# EasyEDA Pro project SmartHome-Voice-Assit.epro, schematic SubBoard
Board Name: SubBoard_v1.1; Create Date: 2025-05-21; Page Name: P1; Project Name: ESP-Spot-Remake; Schematic Name: SubBoard; Update Date: 2025-05-20; Company: 嘉立创EDA; Page Size: A4; Version: V1.0
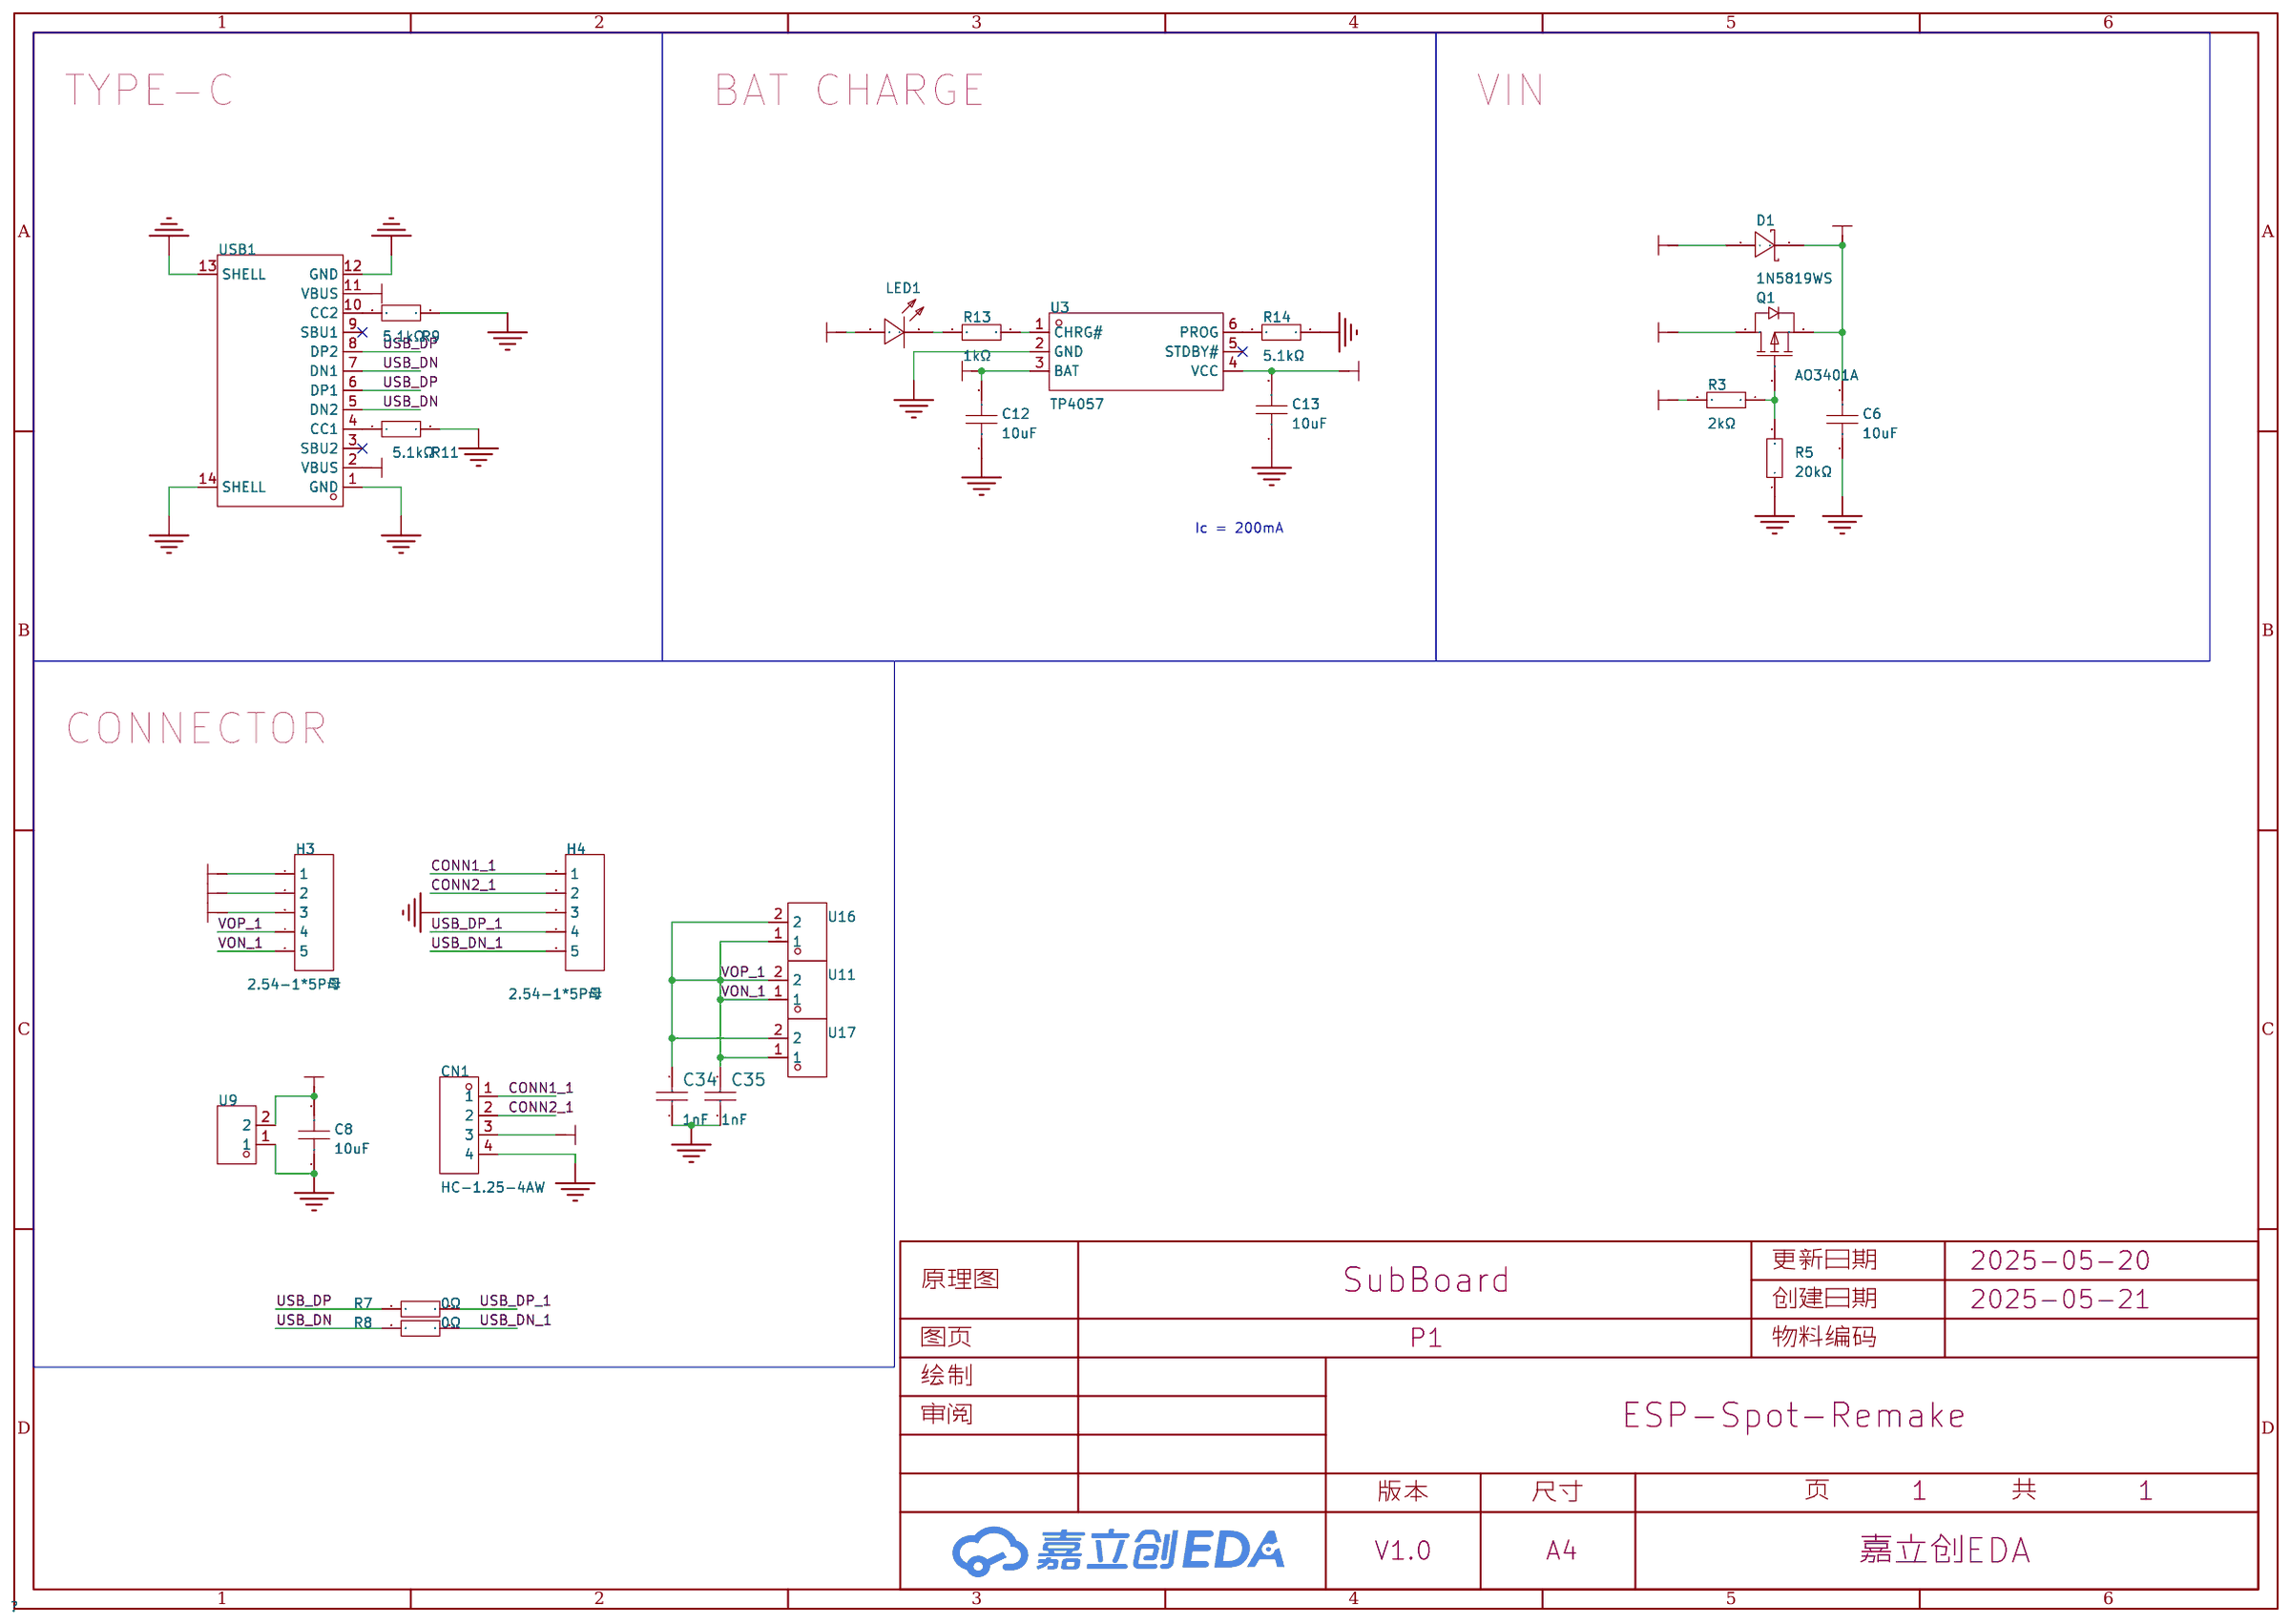
[diagram p0: schematic sheet]

## Parts
C6  10uF  [C0603]
C8  10uF  [C0603]
C12  10uF  [C0603]
C13  10uF  [C0603]
C34  1nF  [C0402]
C35  1nF  [C0402]
CN1  HC-1.25-4AW  [CONN-TH_4P-P1.25_HCTL_HC-1.25-4AW]
D1  1N5819WS  [SOD-323_L1.8-W1.3-LS2.5-RD]
H3  2.54-1*5P母  [HDR-TH_5P-P2.54-V-F]
H4  2.54-1*5P母  [HDR-TH_5P-P2.54-V-F]
LED1  KT-0603R  [LED0603-RD]
Q1  AO3401A  [SOT-23_L2.9-W1.3-P1.90-LS2.4-BR]
R3  2kΩ  [R0402]
R5  20kΩ  [R0402]
R7  0Ω  [R0402]
R8  0Ω  [R0402]
R9  5.1kΩ  [R0402]
R11  5.1kΩ  [R0402]
R13  1kΩ  [R0402]
R14  5.1kΩ  [R0402]
U3  TP4057  [SOT-23-6_L2.9-W1.6-P0.95-LS2.8-BR]
U9  ZX-MX1.25-2PWZ  [CONN-TH_2P-P1.25_ZX-MX1.25-2PWZ]
U11  ZX-MX1.25-2PWZ  [CONN-TH_2P-P1.25_ZX-MX1.25-2PWZ]
U16  ZX-MX1.25-2PWZ  [CONN-TH_2P-P1.25_ZX-MX1.25-2PWZ]
U17  ZX-MX1.25-2PWZ  [CONN-TH_2P-P1.25_ZX-MX1.25-2PWZ]
USB1  TYPE-C 16PIN 2MD(073)  [USB-C-SMD_TYPE-C-6PIN-2MD-073]

## Library data of the parts
C6 C8 C12 C13 = CL10A106KP8NNNC: 容值:10uF;精度:±10%;额定电压:10V;材质(温度系数):X5R;; LCSC Part Name: 10uF ±10% 10V; Supplier Part: C19702; Manufacturer: SAMSUNG(三星); Supplier Footprint: 0603; JLCPCB Part Class: Basic Part; Datasheet: https://atta.szlcsc.com/upload/public/pdf/source/20160218/1457707763339.pdf; Supplier: LCSC; Tolerance: ±10%; Voltage Rated: 10V; Temperature Coefficient: X5R
C34 C35 = 0402B102K500NT: 容值:1nF;精度:±10%;额定电压:50V;材质(温度系数):X7R;; LCSC Part Name: 1nF ±10% 50V; Supplier Part: C1523; Manufacturer: FH(风华); Supplier Footprint: 0402; Datasheet: https://atta.szlcsc.com/upload/public/pdf/source/20200305/C486355_26A10D38EF8C2A5C37091D0039909270.pdf; Supplier: LCSC; Tolerance: ±10%; Voltage Rated: 50V; Temperature Coefficient: X7R; Check: true
CN1 = HC-1.25-4AW: 插针结构:1x4P;间距:1.25mm;安装方式:弯插;参考系列:PicoBlade(MX 1.25);总PIN数:4P;排数:1;每排PIN数:4;行距:-;额定电流:1A;触头材质:黄铜;触头镀层:锡;工作温度范围:-25℃~+85℃;; LCSC Part Name: 1x4P 间距:1.25mm 弯插 系列:PicoBlade(MX 1.25); Supplier Part: C2845537; Manufacturer: HCTL(华灿天禄); Supplier Footprint: 弯插,P=1.25mm; JLCPCB Part Class: 扩展库; Datasheet: https://atta.szlcsc.com/upload/public/pdf/source/20230707/04F6BEA69F699E7BB6558EF06AF1DC24.pdf; Supplier: LCSC; Pins Structure: 1x4P; Pitch: 1.25mm; Mounting Style: 弯插; Reference Series: PicoBlade(MX 1.25); Number of Pins: 4P; Number of Rows: 1; Number of PINs Per Row: 4; Current Rating (Max): 1A; Contact Material: 黄铜; Contact Plating: 锡; Operating Temperature Range: -25℃~+85℃; Rated Voltage (Max): 125V; Plastic Material: PA46; Flame Retardant Rating: UL94V-0; Z-Height of the Board: 3.2mm; X-Length of Bottom Edge on Board (Spacing Line): 6.75mm; Y-Width of Bottom Edge on Board: 4.7mm
D1 = 1N5819WS_C191023: 正向压降(Vf):600mV@1A;直流反向耐压(Vr):40V;整流电流:1A;; LCSC Part Name: 电压:40V 电流:1A; Supplier Part: C191023; Manufacturer: Hottech(合科泰); Supplier Footprint: SOD-323; JLCPCB Part Class: 基础库; Datasheet: https://atta.szlcsc.com/upload/public/pdf/source/20220428/3CB86FD8D28D653594B4E35F9D5AEFD9.pdf; Supplier: LCSC; Forward Voltage (Vf@If): 600mV@1A; Reverse Voltage (Vr): 40V; Rectified Current: 1A
H3 H4 = 2.54-1*5P母: 插孔结构:1x5P;间距:2.54mm;行距:-;安装类型:直插;排数:单排;总孔位数:5P;塑高:-;触头材质:-;触头镀层:-;; LCSC Part Name: 间距:2.54mm 1x5P 直插; Supplier Part: C50950; Manufacturer: BOOMELE(博穆精密); Supplier Footprint: 插件,P=2.54mm; JLCPCB Part Class: Extended Part; Datasheet: https://atta.szlcsc.com/upload/public/pdf/source/20210301/C2718488_F4427B881E42CAA8DDB0B1C12B3A522C.pdf; Supplier: LCSC; Holes Structure: 1x5P; Pitch: 2.54mm; Mounting Type: 直插; Number of Rows: 单排; Number of Holes: 5P
LED1 = KT-0603R: 发光颜色:红色;功率:-;正向电流:-;主波长:-;二极管配置:-;透镜颜色:-;色温:-;发光角度:-;载带方式:-;工作温度:-40℃~+85℃;; LCSC Part Name: 0603 红灯 高亮; Supplier Part: C2286; Manufacturer: KENTO; Supplier Footprint: 0603; JLCPCB Part Class: 基础库; Datasheet: https://atta.szlcsc.com/upload/public/pdf/source/20160616/1466072038404.pdf; Supplier: LCSC; Emitted Color: 红色; Operating Temperature: -40℃~+85℃
Q1 = AO3401A_C15127: 类型:1个P沟道;漏源电压(Vdss):30V;连续漏极电流(Id):4A;导通电阻(RDS(on)@Vgs,Id):44mΩ@10V,4.3A;功率(Pd):1.4W;阈值电压(Vgs(th)@Id):1.3V@250uA;; LCSC Part Name: 1个P沟道 耐压:30V 电流:4A; Supplier Part: C15127; Manufacturer: AOS; Supplier Footprint: SOT-23; JLCPCB Part Class: 基础库; Datasheet: https://atta.szlcsc.com/upload/public/pdf/source/20160507/1462613609053.pdf; Supplier: LCSC; Type: 1个P沟道; Drain Source Voltage (Vdss): 30V; Continuous Drain Current (Id): 4A; Drain Source On Resistance (RDS(on)@Vgs,Id): 44mΩ@10V,4.3A; Power Dissipation (Pd): 1.4W; Gate Threshold Voltage (Vgs(th)@Id): 1.3V@250uA; Total Gate Charge (Qg@Vgs): 12.2nC@4.5V; Input Capacitance (Ciss@Vds): 1.2nF@15V; Operating Temperature: -55℃~+150℃@(Tj)
R3 = 0402WGF2001TCE: 电阻类型:厚膜电阻;阻值:2kΩ;精度:±1%;功率:62.5mW;最大工作电压:50V;温度系数:±100ppm/℃;; LCSC Part Name: 2kΩ ±1% 62.5mW 厚膜电阻; Supplier Part: C4109; Manufacturer: UNI-ROYAL(厚声); Supplier Footprint: 0402; JLCPCB Part Class: Basic Part; Datasheet: https://atta.szlcsc.com/upload/public/pdf/source/20200306/C422600_1E6D84923E4A46A82E41ADD87F860B5C.pdf; Supplier: LCSC; Type: 厚膜电阻; Tolerance: ±1%; Power(Watts): 62.5mW; Overload Voltage (Max): 50V; Temperature Coefficient: ±100ppm/℃; Operating Temperature Range: -55℃~+155℃
R5 = 0402WGF2002TCE: 电阻类型:厚膜电阻;阻值:20kΩ;精度:±1%;功率:62.5mW;最大工作电压:50V;温度系数:±100ppm/℃;; LCSC Part Name: 20kΩ ±1% 62.5mW 厚膜电阻; Supplier Part: C25765; Manufacturer: UNI-ROYAL(厚声); Supplier Footprint: 0402; JLCPCB Part Class: Basic Part; Datasheet: https://atta.szlcsc.com/upload/public/pdf/source/20200306/C422600_1E6D84923E4A46A82E41ADD87F860B5C.pdf; Supplier: LCSC; Type: 厚膜电阻; Tolerance: ±1%; Power(Watts): 62.5mW; Overload Voltage (Max): 50V; Temperature Coefficient: ±100ppm/℃; Operating Temperature Range: -55℃~+155℃
R7 R8 = 0402WGF0000TCE: 电阻类型:厚膜电阻;阻值:0Ω;精度:±1%;功率:62.5mW;; LCSC Part Name: 0Ω ±1% 62.5mW; Supplier Part: C17168; Manufacturer: UNI-ROYAL(厚声); Supplier Footprint: 0402; Datasheet: https://atta.szlcsc.com/upload/public/pdf/source/20200306/C422600_1E6D84923E4A46A82E41ADD87F860B5C.pdf; Supplier: LCSC; Type: 厚膜电阻; Tolerance: ±1%; Power(Watts): 62.5mW; Temperature Coefficient: ±800ppm/℃; Overload Voltage (Max): 50V; Operating Temperature Range: -55℃~+155℃; Check: true
R9 R11 R14 = 0402WGF5101TCE: 电阻类型:厚膜电阻;阻值:5.1kΩ;精度:±1%;功率:62.5mW;最大工作电压:50V;温度系数:±100ppm/℃;; LCSC Part Name: 5.1kΩ ±1% 62.5mW 厚膜电阻; Supplier Part: C25905; Manufacturer: UNI-ROYAL(厚声); Supplier Footprint: 0402; JLCPCB Part Class: Basic Part; Datasheet: https://atta.szlcsc.com/upload/public/pdf/source/20200306/C422600_1E6D84923E4A46A82E41ADD87F860B5C.pdf; Supplier: LCSC; Type: 厚膜电阻; Tolerance: ±1%; Power(Watts): 62.5mW; Overload Voltage (Max): 50V; Temperature Coefficient: ±100ppm/℃; Operating Temperature Range: -55℃~+155℃
R13 = 0402WGF1001TCE: 电阻类型:厚膜电阻;阻值:1kΩ;精度:±1%;功率:62.5mW;最大工作电压:50V;温度系数:±100ppm/℃;; LCSC Part Name: 1kΩ ±1% 62.5mW 厚膜电阻; Supplier Part: C11702; Manufacturer: UNI-ROYAL(厚声); Supplier Footprint: 0402; JLCPCB Part Class: Basic Part; Datasheet: https://atta.szlcsc.com/upload/public/pdf/source/20200306/C422600_1E6D84923E4A46A82E41ADD87F860B5C.pdf; Supplier: LCSC; Type: 厚膜电阻; Tolerance: ±1%; Power(Watts): 62.5mW; Overload Voltage (Max): 50V; Temperature Coefficient: ±100ppm/℃; Operating Temperature Range: -55℃~+155℃
U3 = TP4057: 电源电压:6.5V;最大充电电流:500mA;电池类型:锂离子/聚合物;电池节数:1;; Supplier Part: C725791; Manufacturer: UMW(友台半导体); Supplier Footprint: SOT-23-6; JLCPCB Part Class: 扩展库; Datasheet: https://atta.szlcsc.com/upload/public/pdf/source/20231109/7FB39B0490CD1514A6792371FCA0BB30.pdf; Supplier: LCSC; Supply Voltage: 6.5V; Maximum Charge Current: 500mA; Type of Battery: 锂离子/聚合物; Number of Cells: 1; Operating Temperature: -40℃~+85℃
U9 = ZX-MX1.25-2PWZ: 插针结构:1x2P;间距:1.25mm;安装方式:弯插;参考系列:PicoBlade(MX 1.25);总PIN数:2P;排数:1;每排PIN数:2;行距:-;额定电流:-;触头材质:黄铜;触头镀层:锡;工作温度范围:-;; LCSC Part Name: 1x2P 间距:1.25mm 弯插 系列:PicoBlade(MX 1.25) 配套胶壳型号：ZX-MX1.25-2PJK 配套端子型号：ZX-MX1.25-DZ 配套杜邦线型号：ZX-MX1.25-2PBXC; Supplier Part: C7430463; Manufacturer: Megastar(兆星); Supplier Footprint: 弯插,P=1.25mm; JLCPCB Part Class: 扩展库; Datasheet: https://atta.szlcsc.com/upload/public/pdf/source/20230619/EFC7482EB916E36F9EF0B03A9637C24F.pdf; Supplier: LCSC; Pins Structure: 1x2P; Pitch: 1.25mm; Mounting Style: 弯插; Reference Series: PicoBlade(MX 1.25); Number of Pins: 2P; Number of Rows: 1; Number of PINs Per Row: 2; Contact Material: 黄铜; Contact Plating: 锡; Colour: 白色; Z-Height of the Board: 3.3mm; X-Length of Bottom Edge on Board (Spacing Line): 4.4mm; Y-Width of Bottom Edge on Board: 4.6mm
U11 U16 U17 = ZX-MX1.25-2PWZ: 插针结构:1x2P;间距:1.25mm;安装方式:弯插;参考系列:PicoBlade(MX 1.25);总PIN数:2P;排数:1;每排PIN数:2;行距:-;额定电流:-;触头材质:黄铜;触头镀层:锡;工作温度范围:-;; LCSC Part Name: 1x2P 间距:1.25mm 弯插 系列:PicoBlade(MX 1.25) 配套胶壳型号：ZX-MX1.25-2PJK 配套端子型号：ZX-MX1.25-DZ 配套杜邦线型号：ZX-MX1.25-2PBXC; Supplier Part: C7430463; Manufacturer: Megastar(兆星); Supplier Footprint: 弯插,P=1.25mm; JLCPCB Part Class: Extended Part; Datasheet: https://atta.szlcsc.com/upload/public/pdf/source/20230619/EFC7482EB916E36F9EF0B03A9637C24F.pdf; Supplier: LCSC; Pins Structure: 1x2P; Pitch: 1.25mm; Mounting Style: 弯插; Reference Series: PicoBlade(MX 1.25); Number of Pins: 2P; Number of Rows: 1; Number of PINs Per Row: 2; Contact Material: 黄铜; Contact Plating: 锡; Colour: 白色; Z-Height of the Board: 3.3mm; X-Length of Bottom Edge on Board (Spacing Line): 4.4mm; Y-Width of Bottom Edge on Board: 4.6mm
USB1 = TYPE-C 16PIN 2MD(073): 连接器类型:Type-C;标准:USB 3.1;公母:母;安装方式:卧贴;触点数量:16P;端口数量:1;额定电流 - 电源:5A;工作温度范围:-25℃~+85℃;; LCSC Part Name: Type-C 母 卧贴; Supplier Part: C2765186; Manufacturer: SHOU HAN(首韩); Supplier Footprint: SMD; JLCPCB Part Class: 扩展库; Datasheet: https://atta.szlcsc.com/upload/public/pdf/source/20211123/39B17C16241EAC15C5E277BDA434118E.pdf; Supplier: LCSC; Connector Type: Type-C; Standard: USB 3.1; Gender: 母; Mounting Style: 卧贴; Number of Contacts: 16P; Number of Ports: 1; Current Rating - Power (Max): 5A; Operating Temperature Range: -25℃~+85℃; Rated Voltage (Max): 5V; Connect-Disconnect Life: 5千次; Core Colour: 黑色

## Nets
GND: C6.1 C8.1 C12.1 C13.1 C34.1 C35.1 CN1.4 H4.3 R5.1 R9.2 R11.2 R14.1 U3.2(GND) U9.1 USB1.1(GND) USB1.12(GND) USB1.13(SHELL) USB1.14(SHELL)
VBAT_1: C8.2 C12.2 H3.1 Q1.3(D) U3.3(BAT) U9.2
VBUS_1: C13.2 D1.2(A) H3.3 LED1.2(A) R3.2 U3.4(VCC) USB1.2(VBUS) USB1.11(VBUS)
VIN_1: C6.2 CN1.3 D1.1(K) H3.2 Q1.2(S)
CONN1_1: CN1.1 H4.1
CONN2_1: CN1.2 H4.2
USB_DN: R8.2 USB1.5(DN2) USB1.7(DN1)
USB_DN_1: H4.5 R8.1
USB_DP: R7.2 USB1.6(DP1) USB1.8(DP2)
USB_DP_1: H4.4 R7.1
VON_1: C35.2 H3.5 U11.1 U16.1 U17.1
VOP_1: C34.2 H3.4 U11.2 U16.2 U17.2
$1N1534: R13.1 U3.1(CHRG#)
$1N1535: LED1.1(K) R13.2
$1N1542: R14.2 U3.6(PROG)
$1N1544: R11.1 USB1.4(CC1)
$1N1545: R9.1 USB1.10(CC2)
$1N1550: Q1.1(G) R3.1 R5.2

Not connected (* = marked no-connect by the designer): U3 5(STDBY#)*; USB1 3(SBU2)* 9(SBU1)*

## Notes on the sheet
- TYPE-C
- BAT CHARGE
- VIN
- Ic = 200mA
- CONNECTOR
